# EasyEDA Pro project eLight_core.epro, schematic SCH_linear
Board Name: eLight_core_linear; Create Date: 2025-04-20; Page Name: P1; Project Name: eLight_core; Schematic Name: SCH_linear; Update Date: 2025-04-21; Company: 嘉立创EDA; Page Size: A4; Version: V1.0
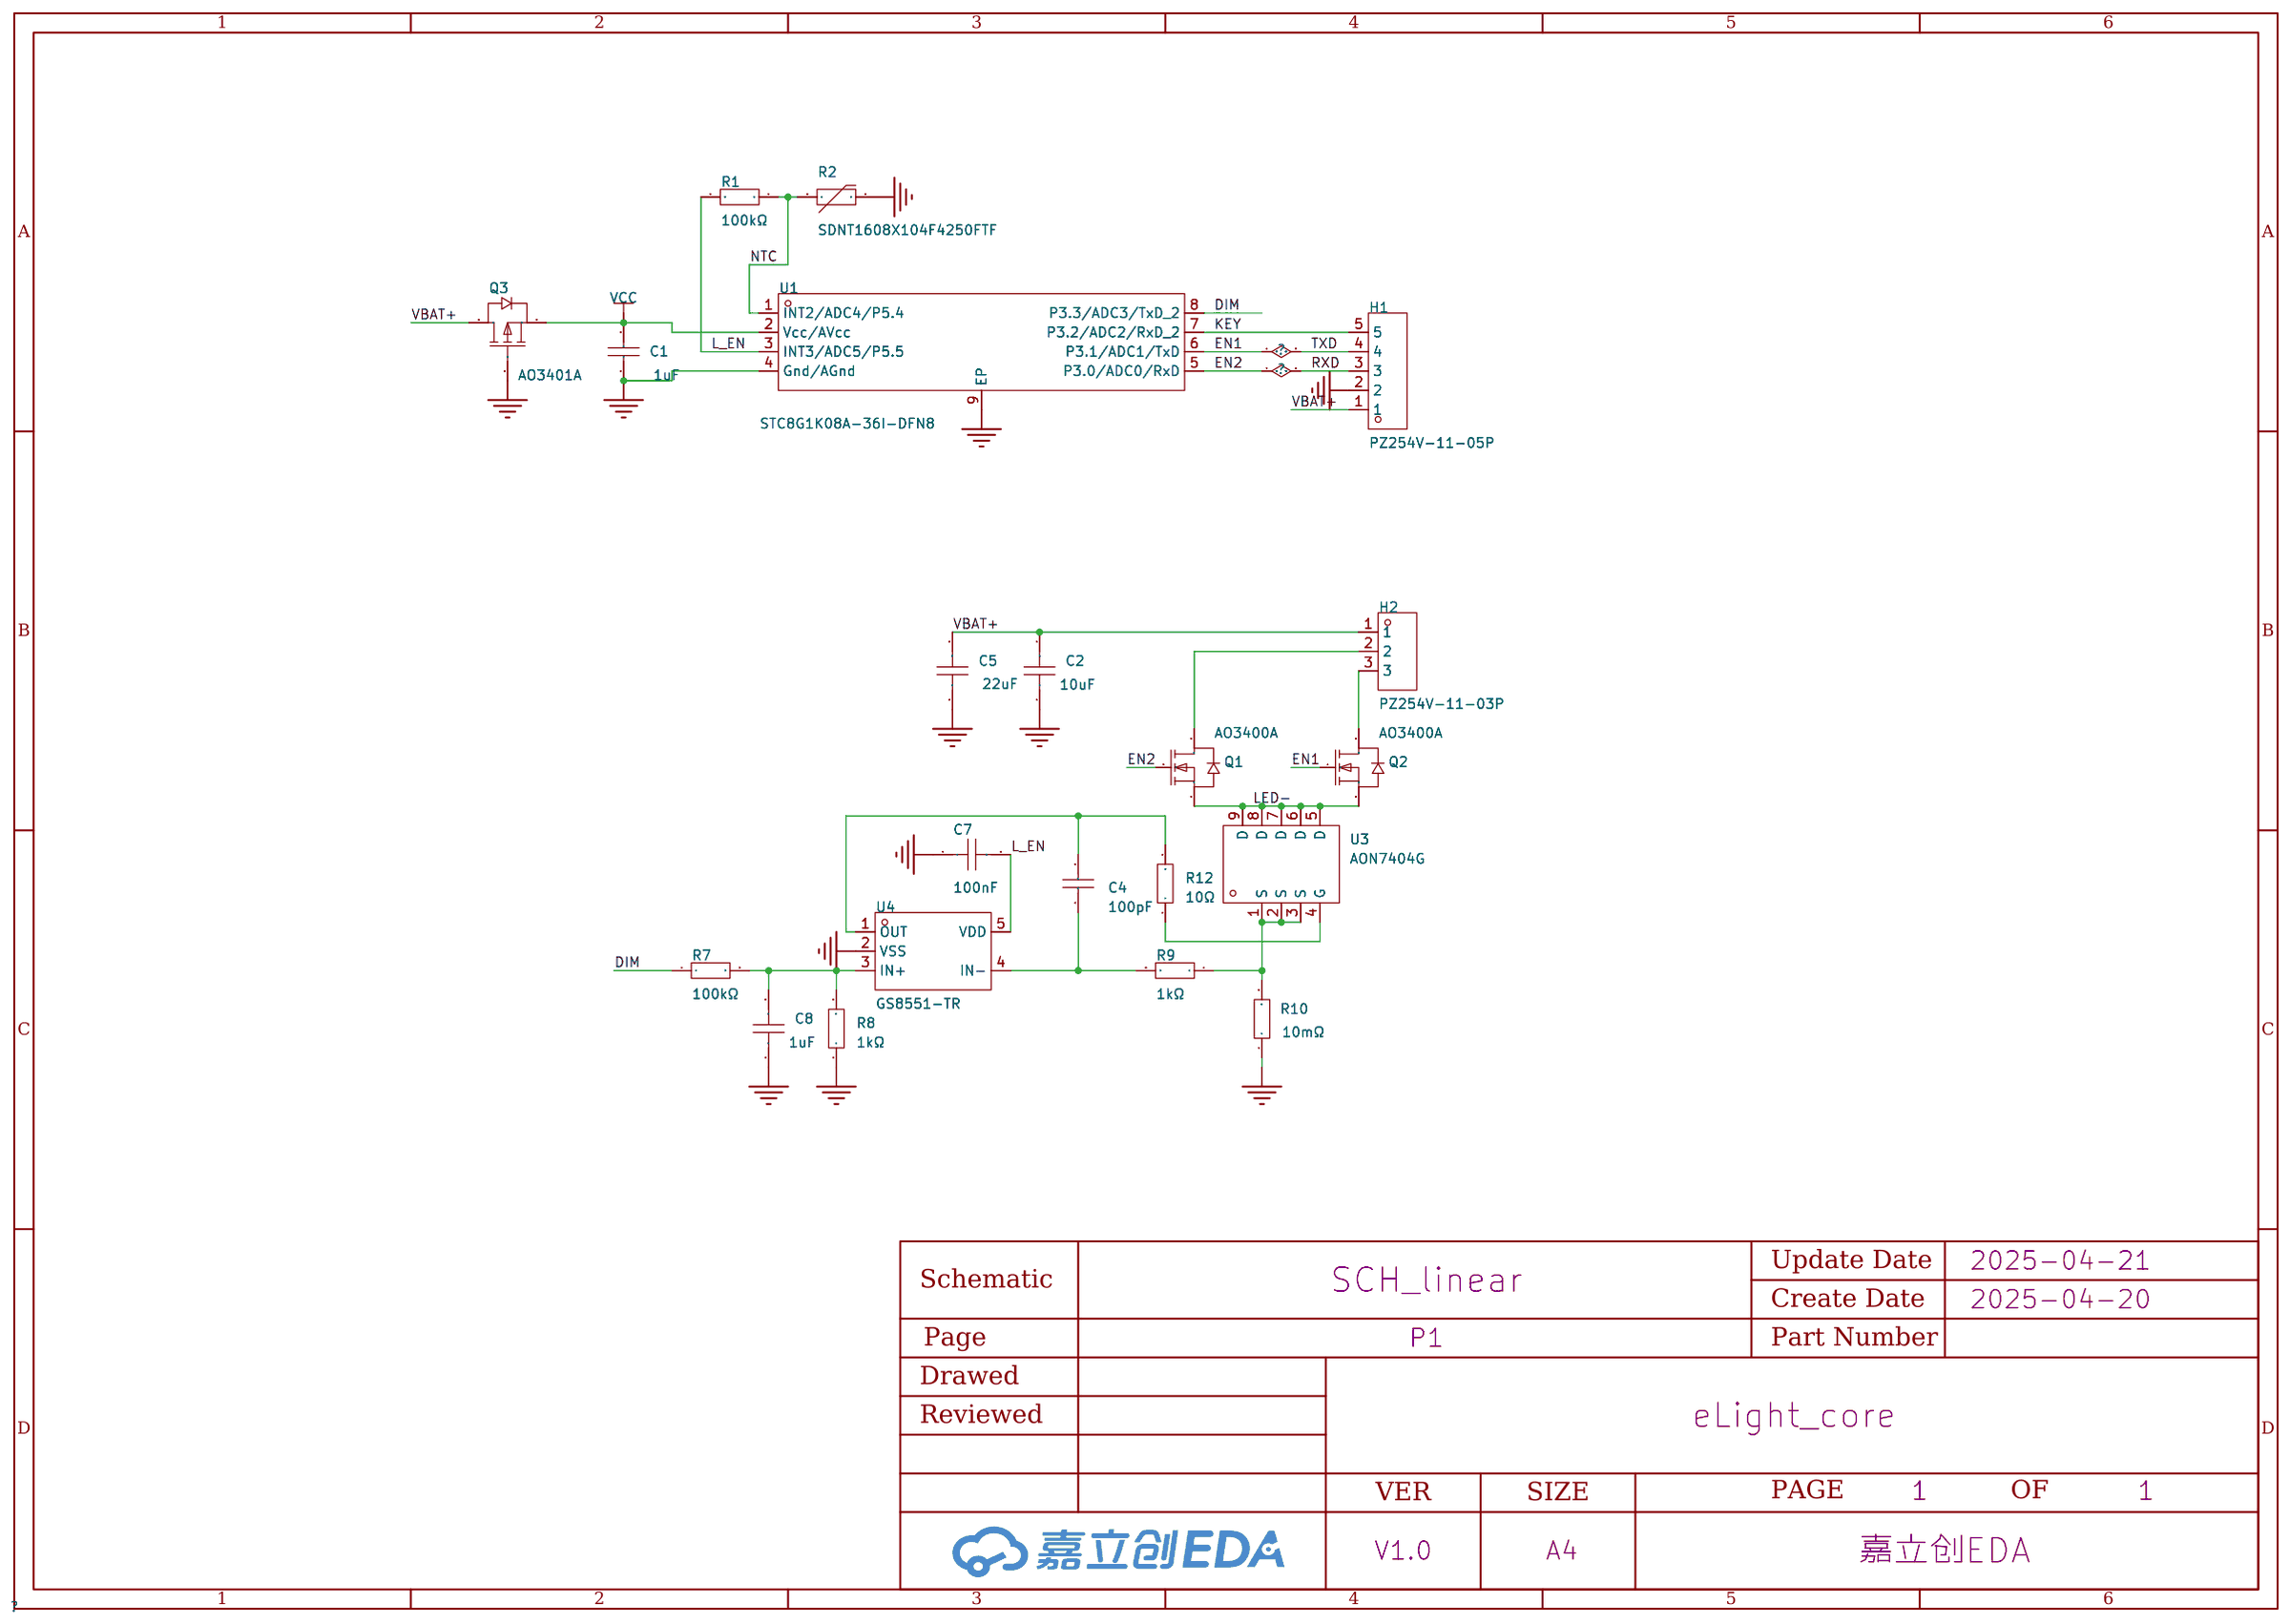
[diagram p2: schematic sheet]

## Parts
C1  1uF  [C0603]
C2  10uF  [C0603]
C4  100pF  [C0603]
C5  22uF  [C0805]
C7  100nF  [C0603]
C8  1uF  [C0603]
H1  PZ254V-11-05P  [HDR-TH_5P-P2.54-V-M]
H2  PZ254V-11-03P  [HDR-TH_3P-P2.54-V-M]
Q1  AO3400A  [SOT-23-3_L2.9-W1.3-P1.90-LS2.4-BR]
Q2  AO3400A  [SOT-23-3_L2.9-W1.3-P1.90-LS2.4-BR]
Q3  AO3401A  [SOT-23_L2.9-W1.3-P1.90-LS2.4-BR]
R1  100kΩ  [R0603]
R2  SDNT1608X104F4250FTF  [R0603]
R7  100kΩ  [R0603]
R8  1kΩ  [R0603]
R9  1kΩ  [R0603]
R10  10mΩ  [R1206]
R12  10Ω  [R0603]
U1  STC8G1K08A-36I-DFN8  [DFN-8_L3.0-W3.0-P0.50-BL-EP]
U3  AON7404G  [DFN-8_L3.0-W3.0-P0.65-BL-2]
U4  GS8551-TR  [SOT-23-5_L3.0-W1.7-P0.95-LS2.8-BR]

## Library data of the parts
C1 = CL10A105KB8NNNC: 容值:1uF;精度:±10%;额定电压:50V;材质(温度系数):X5R;; LCSC Part Name: 1uF ±10% 50V; Supplier Part: C15849; Manufacturer: SAMSUNG(三星); Supplier Footprint: 0603; JLCPCB Part Class: Basic Part; Datasheet: https://atta.szlcsc.com/upload/public/pdf/source/20160103/1457707679084.pdf; Supplier: LCSC; Tolerance: ±10%; Voltage Rated: 50V; Temperature Coefficient: X5R
C2 = CL10A106KP8NNNC: 容值:10uF;精度:±10%;额定电压:10V;材质(温度系数):X5R;; LCSC Part Name: 10uF ±10% 10V; Supplier Part: C19702; Manufacturer: SAMSUNG(三星); Supplier Footprint: 0603; JLCPCB Part Class: Basic Part; Datasheet: https://atta.szlcsc.com/upload/public/pdf/source/20160103/1457707703378.pdf; Supplier: LCSC; Tolerance: ±10%; Voltage Rated: 10V; Temperature Coefficient: X5R
C4 = CL10C101JB8NNNC: 容值:100pF;精度:±5%;额定电压:50V;材质(温度系数):C0G;; LCSC Part Name: 100pF ±5% 50V; Supplier Part: C14858; Manufacturer: SAMSUNG(三星); Supplier Footprint: 0603; JLCPCB Part Class: 基础库; Datasheet: https://atta.szlcsc.com/upload/public/pdf/source/20160218/1457707763339.pdf; Supplier: LCSC; Tolerance: ±5%; Voltage Rated: 50V; Temperature Coefficient: C0G
C5 = CL21A226MAQNNNE_C45783: 容值:22uF;精度:±20%;额定电压:25V;材质(温度系数):X5R;; LCSC Part Name: 22uF ±20% 25V; Supplier Part: C45783; Manufacturer: SAMSUNG(三星); Manufacturer Part: CL21A226MAQNNNE; Supplier Footprint: 0805; JLCPCB Part Class: Basic Part; Datasheet: https://atta.szlcsc.com/upload/public/pdf/source/20160103/1457707727161.pdf; Supplier: LCSC; Tolerance: ±20%; Voltage Rated: 25V; Temperature Coefficient: X5R
C7 = CC0603KRX7R9BB104: 容值:100nF;精度:±10%;额定电压:50V;材质(温度系数):X7R;; LCSC Part Name: 100nF ±10% 50V; Supplier Part: C14663; Manufacturer: YAGEO(国巨); Supplier Footprint: 0603; JLCPCB Part Class: Basic Part; Datasheet: https://atta.szlcsc.com/upload/public/pdf/source/20170116/1484561234239.pdf; Supplier: LCSC; Tolerance: ±10%; Voltage Rated: 50V; Temperature Coefficient: X7R
C8 = CL10A105KB8NNNC: 温度系数:X5R;精度:±10%;额定电压:50V;容值:1uF;; LCSC Part Name: 1uF ±10% 50V; Supplier Part: C15849; Manufacturer: SAMSUNG(三星); Supplier Footprint: 0603; JLCPCB Part Class: Basic Part; Datasheet: https://atta.szlcsc.com/upload/public/pdf/source/20160103/1457707679084.pdf; Supplier: LCSC; Tolerance: ±10%; Voltage Rated: 50V; Temperature Coefficient: X5R
H1 = PZ254V-11-05P: 插针结构:1x5P;间距:2.54mm;行距:-;圆针/方针:方针;安装类型:直插;排数:单排;总PIN位数:5P;额定电流:-;额定电压:-;配合针长度:6mm;塑高:2.5mm;端接针长度:3mm;触头材质:黄铜;触头镀层:-;工作温度范围:-40℃~+105℃;颜色:黑色;; LCSC Part Name: 间距:2.54mm 1x5P 直插 方针; Supplier Part: C492404; Manufacturer: XFCN(兴飞); Supplier Footprint: 插件,P=2.54mm; JLCPCB Part Class: 扩展库; Datasheet: https://atta.szlcsc.com/upload/public/pdf/source/20200309/C492404_E51533260F8710EFF5D4617281164C1D.pdf; Supplier: LCSC; Pin Structure: 1x5P; Pitch: 2.54mm; Circluar Pins/Square Pins: 方针; Mounting Type: 直插; Number of Rows: 单排; Number of Pins: 5P; Length of Mating Pin: 6mm; Insulation Height: 2.5mm; Length of End Connection Pin: 3mm; Contact Material: 黄铜; Operating Temperature Range: -40℃~+105℃; Color: 黑色
H2 = PZ254V-11-03P: 插针结构:1x3P;间距:2.54mm;行距:-;圆针/方针:方针;安装类型:直插;排数:单排;总PIN位数:3P;额定电流:3A;额定电压:250V;配合针长度:6mm;塑高:2.5mm;端接针长度:3mm;工作温度范围:-40℃~+105℃;颜色:黑色;; LCSC Part Name: 间距:2.54mm 1x3P 直插 方针; Supplier Part: C2937625; Manufacturer: XFCN(兴飞); Supplier Footprint: 插件,P=2.54mm; JLCPCB Part Class: 扩展库; Datasheet: https://atta.szlcsc.com/upload/public/pdf/source/20200309/C492402_8335C3D49C4E4C618838D59BB1D024C1.pdf; Supplier: LCSC; Pin Structure: 1x3P; Pitch: 2.54mm; Circluar Pins/Square Pins: 方针; Mounting Type: 直插; Number of Rows: 单排; Number of Pins: 3P; Current Rating (Max): 3A; Voltage Rating (Max): 250V; Length of Mating Pin: 6mm; Insulation Height: 2.5mm; Length of End Connection Pin: 3mm; Operating Temperature Range: -40℃~+105℃; Color: 黑色
Q1 Q2 = AO3400A_C347475: 类型:1个N沟道;漏源电压(Vdss):30V;连续漏极电流(Id):5.8A;功率(Pd):1.4W;导通电阻(RDS(on)@Vgs,Id):35mΩ@10V,5.8A;阈值电压(Vgs(th)@Id):1.4V@250uA;; LCSC Part Name: 1个N沟道 耐压:30V 电流:5.8A; Supplier Part: C347475; Manufacturer: UMW(友台半导体); Supplier Footprint: SOT-23; JLCPCB Part Class: 扩展库; Datasheet: https://atta.szlcsc.com/upload/public/pdf/source/20231109/50AB4FB4D66E55864F9B8D027B723C9A.pdf; Supplier: LCSC; Type: 1个N沟道; Drain Source Voltage (Vdss): 30V; Continuous Drain Current (Id): 5.8A; Power Dissipation (Pd): 1.4W; Drain Source On Resistance (RDS(on)@Vgs,Id): 35mΩ@10V,5.8A; Gate Threshold Voltage (Vgs(th)@Id): 1.4V@250uA; Total Gate Charge (Qg@Vgs): 12nC@4.5V; Input Capacitance (Ciss@Vds): 1.05nF@15V; Operating Temperature: -55℃~+150℃@(Tj)
Q3 = AO3401A_C15127: 类型:1个P沟道;漏源电压(Vdss):30V;连续漏极电流(Id):4A;导通电阻(RDS(on)@Vgs,Id):44mΩ@10V,4.3A;功率(Pd):1.4W;阈值电压(Vgs(th)@Id):1.3V@250uA;; LCSC Part Name: 1个P沟道 耐压:30V 电流:4A; Supplier Part: C15127; Manufacturer: AOS; Supplier Footprint: SOT-23; JLCPCB Part Class: 基础库; Datasheet: https://atta.szlcsc.com/upload/public/pdf/source/20160507/1462613609053.pdf; Supplier: LCSC; Type: 1个P沟道; Drain Source Voltage (Vdss): 30V; Continuous Drain Current (Id): 4A; Drain Source On Resistance (RDS(on)@Vgs,Id): 44mΩ@10V,4.3A; Power Dissipation (Pd): 1.4W; Gate Threshold Voltage (Vgs(th)@Id): 1.3V@250uA; Total Gate Charge (Qg@Vgs): 12.2nC@4.5V; Input Capacitance (Ciss@Vds): 1.2nF@15V; Operating Temperature: -55℃~+150℃@(Tj)
R1 R7 = 0603WAF1003T5E: 电阻类型:厚膜电阻;阻值:100kΩ;精度:±1%;功率:100mW;温度系数:±100ppm/℃;最大工作电压:75V;工作温度范围:-55℃~+155℃;; LCSC Part Name: 100kΩ ±1% 100mW; Supplier Part: C25803; Manufacturer: UNI-ROYAL(厚声); Supplier Footprint: 0603; JLCPCB Part Class: Basic Part; Datasheet: https://atta.szlcsc.com/upload/public/pdf/source/20200306/C422600_1E6D84923E4A46A82E41ADD87F860B5C.pdf; Supplier: LCSC; Type: 厚膜电阻; Tolerance: ±1%; Power(Watts): 100mW; Temperature Coefficient: ±100ppm/℃; Overload Voltage (Max): 75V; Operating Temperature Range: -55℃~+155℃
R2 = SDNT1608X104F4250FTF: 阻值(25℃):100kΩ;B值(25℃/50℃):4250K;电阻精度:±1%;功率:100mW;B值精度:±1%;最大稳态电流(25℃):100uA;; LCSC Part Name: 100kΩ 电阻精度:±1% 4250K; Supplier Part: C95955; Manufacturer: Sunlord(顺络); Supplier Footprint: 0603; JLCPCB Part Class: 扩展库; Datasheet: https://atta.szlcsc.com/upload/public/pdf/source/20210916/BF106A3565EDFEB141CB3E0EA3A661F8.pdf; Supplier: LCSC; Resistance @ 25℃: 100kΩ; B Constant (25℃/50℃): 4250K; Resistance Tolerance: ±1%; Power: 100mW; B Constant Tolerance: ±1%; Steady State Current (Max): 100uA; Operating Temperature: -55℃~+125℃
R8 R9 = 0603WAF1001T5E: 电阻类型:厚膜电阻;阻值:1kΩ;精度:±1%;功率:100mW;温度系数:±100ppm/℃;最大工作电压:75V;工作温度范围:-55℃~+155℃;; LCSC Part Name: 1kΩ ±1% 100mW; Supplier Part: C21190; Manufacturer: UNI-ROYAL(厚声); Supplier Footprint: 0603; JLCPCB Part Class: Basic Part; Datasheet: https://atta.szlcsc.com/upload/public/pdf/source/20200306/C422600_1E6D84923E4A46A82E41ADD87F860B5C.pdf; Supplier: LCSC; Type: 厚膜电阻; Tolerance: ±1%; Power(Watts): 100mW; Temperature Coefficient: ±100ppm/℃; Overload Voltage (Max): 75V; Operating Temperature Range: -55℃~+155℃
R10 = FMF06FTHR010-LH: 阻值:10mΩ;精度:±1%;功率:1W;温度系数:±70ppm/℃;; LCSC Part Name: 10mΩ ±1% 1W; Supplier Part: C105362; Manufacturer: PSA(信昌电陶); Supplier Footprint: 1206; JLCPCB Part Class: Extended Part; Datasheet: https://atta.szlcsc.com/upload/public/pdf/source/20170410/1491788444486.pdf; Supplier: LCSC; Tolerance: ±1%; Power(Watts): 1W; Temperature Coefficient: ±70ppm/℃
R12 = 0603WAF100JT5E: 电阻类型:厚膜电阻;阻值:10Ω;精度:±1%;功率:100mW;最大工作电压:75V;温度系数:±400ppm/℃;; LCSC Part Name: 10Ω ±1% 100mW 厚膜电阻; Supplier Part: C22859; Manufacturer: UNI-ROYAL(厚声); Supplier Footprint: 0603; JLCPCB Part Class: 基础库; Datasheet: https://atta.szlcsc.com/upload/public/pdf/source/20200306/C422600_1E6D84923E4A46A82E41ADD87F860B5C.pdf; Supplier: LCSC; Type: 厚膜电阻; Tolerance: ±1%; Power(Watts): 100mW; Overload Voltage (Max): 75V; Temperature Coefficient: ±400ppm/℃; Operating Temperature Range: -55℃~+155℃
U1 = STC8G1K08A-36I-DFN8: CPU内核:51系列;程序存储容量:8KB;GPIO端口数量:-;工作电压范围:-;CPU最大主频:-;程序存储器类型:FLASH;; Supplier Part: C915664; Manufacturer: STC(宏晶); Supplier Footprint: DFN-8-EP(3x3); JLCPCB Part Class: 扩展库; Datasheet: https://atta.szlcsc.com/upload/public/pdf/source/20230914/7707908C45C6343AE73767C1466DDB8D.pdf; Supplier: LCSC; CPU Core: 51系列; Program Storage Size: 8KB; Program Memory Type: FLASH; Internal Oscillator: 有
U3 = AON7404G: 类型:N沟道;漏源电压(Vdss):20V;连续漏极电流(Id):20A；20A;功率(Pd):5W；28W;导通电阻(RDS(on)@Vgs,Id):5.3mΩ@20A,4.5V;阈值电压(Vgs(th)@Id):1.25V@250uA;栅极电荷(Qg@Vgs):45nC@4.5V;输入电容(Ciss@Vds):3.3nF@10V;工作温度:-55℃~+150℃@(Tj);; LCSC Part Name: N沟道 20V 20A 20A; Supplier Part: C3288325; Manufacturer: AOS; Supplier Footprint: DFN-8_EP(3x3); Supplier: LCSC; Type: N沟道; Drain Source Voltage (Vdss): 20V; Continuous Drain Current (Id): 20A；20A; Power Dissipation (Pd): 5W；28W; Drain Source On Resistance (RDS(on)@Vgs,Id): 5.3mΩ@20A,4.5V; Gate Threshold Voltage (Vgs(th)@Id): 1.25V@250uA; Total Gate Charge (Qg@Vgs): 45nC@4.5V; Input Capacitance (Ciss@Vds): 3.3nF@10V; Operating Temperature: -55℃~+150℃@(Tj)
U4 = GS8551-TR: 放大器数:单路;增益带宽积(GBP):1.8MHz;压摆率(SR):0.95V/us;; LCSC Part Name: GS8551 SOT-23-5; Supplier Part: C157715; Manufacturer: Gainsil(聚洵); Supplier Footprint: SOT-23-5; JLCPCB Part Class: 扩展库; Datasheet: https://atta.szlcsc.com/upload/public/pdf/source/20200615/C605420_EE0E567F8FF01D919583B114644E1CC3.pdf; Supplier: LCSC; Number of Circuits: 单路; Gain Bandwidth Product(GBP): 1.8MHz; Slew Rate(SR): 0.95V/us; Supply Voltage: 1.8V~5.5V; Supply Current: 180uA; Operating Temperature: -40℃~+125℃

## Nets
GND: C1.1 C2.1 C5.1 C7.1 C8.1 H1.2 Q3.1(G) R2.1 R8.1 R10.1 U1.4(Gnd/AGnd) U1.9(EP) U4.2(VSS)
VBAT+: C2.2 C5.2 H1.1 H2.1 Q3.3(D)
VCC: C1.2 Q3.2(S) U1.2(Vcc/AVcc)
DIM: R7.1 U1.8(P3.3/ADC3/TxD_2)
EN1: H1.4 Q2.1(G) U1.6(P3.1/ADC1/TxD)
EN2: H1.3 Q1.1(G) U1.5(P3.0/ADC0/RxD)
KEY: H1.5 U1.7(P3.2/ADC2/RxD_2)
L_EN: C7.2 R1.2 U1.3(INT3/ADC5/P5.5) U4.5(VDD)
LED-: Q1.2(S) Q2.2(S) U3.5(D) U3.6(D) U3.7(D) U3.8(D) U3.9(D)
NTC: R1.1 R2.2 U1.1(INT2/ADC4/P5.4)
$1N3207: H2.2 Q1.3(D)
$1N7267: H2.3 Q2.3(D)
$1N46981: C8.2 R7.2 R8.2 U4.3(IN+)
$1N46985: C4.2 R9.2 U4.4(IN-)
$1N46986: R9.1 R10.2 U3.1(S) U3.2(S) U3.3(S)
$1N47213: R12.1 U3.4(G)
$1N47219: C4.1 R12.2 U4.1(OUT)
